# EAGLE design Temperaturfühler_V10_DLN18701 (EAGLE 9.6.0)
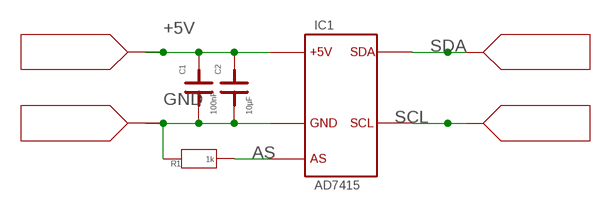
[diagram p0: schematic, sheet 1]

## Parts
C1  100nF  C1  [0805F]
C2  10µF  C1  [0805F]
IC1  AD7415  [SOT23-5L]
LP1  LP1  [LPS1]
LP2  LP1  [LPS1]
LP3  LP1  [LPS1]
LP4  LP1  [LPS1]
R1  1k  R1  [0805]

## Nets
+5V: C1.2 C2.2 IC1.3(+5V) LP3.1
AS: IC1.1(AS) R1.1
GND: C1.1 C2.1 IC1.2(GND) LP4.1 R1.2
SCL: IC1.4(SCL) LP2.1
SDA: IC1.5(SDA) LP1.1

## Library data of the parts
C1 C2 = deto:C
IC1 = deto2:AD7415: AD7415 Tempersatursensor I2C 10Bit 0,5°C
LP1-LP4 = deto:LP: Lötpunkt, SMD oder für Kabel
R1 = deto:R: Widerstand 400 mil - 0805 - 1206

## Board
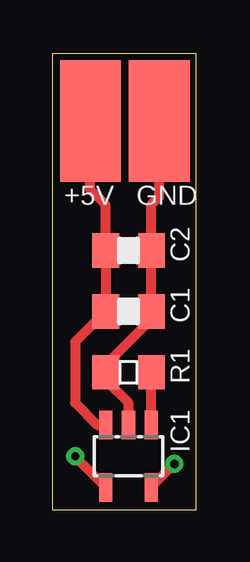
[diagram p1: board, top side]
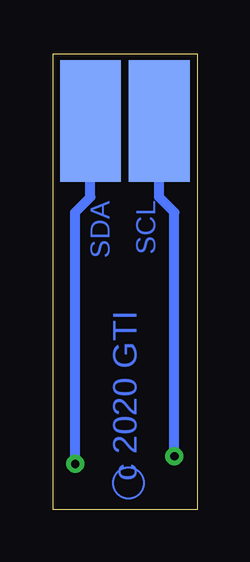
[diagram p2: board, bottom side, seen from below]

No outline drawn. Coordinates in mm, seen from the top.
Copper layers (1*16): Top 0.035mm / dielectric 1.5mm / Bottom 0.035mm
Design rules "default": minimum track width 6mil, minimum drill 0.35mm, track to track 6mil, track to pad 6mil, pad to pad 6mil, via to via 6mil, smd to smd 6mil, copper to edge 40mil, drill to drill 6mil, minimum pad ring 10mil, minimum via ring 8mil, stop-mask expansion 4mil, vias tented up to drill 0mil, thermal gap 10mil
Milling: 4 lines

### Footprints (pad centres in the part's own frame; a part is rotated, then mirrored left to right if it is on the bottom)
0805F = smd 1.118 x 1.422: 1 -0.953,0; 2 0.953,0
SOT23-5L = smd 0.55 x 1.2: 1 -0.95,-1.3; 2 0,-1.3; 3 0.95,-1.3; 4 0.95,1.3; 5 -0.95,1.3
LPS1 = smd 5.08 x 2.54: 1 0,0
0805 = smd 1.118 x 1.422: 1 -0.953,0; 2 0.953,0

### Placement (x,y rotation side)
C1  3.17,8.26 180 top
C2  3.17,10.79 180 top
IC1  3.17,2.22 180 top
LP1  4.45,16.19 90 bottom
LP2  1.59,16.19 90 bottom
LP3  1.59,16.19 90 top
LP4  4.45,16.19 90 top
R1  3.17,5.71 180 top

### Tracks (layer width: path | path; a pad name or v marks a point on that pad's centre or on a via)
+5V
  Top 0.406: LP3.1 1.59,13.34 2.22,12.7 C2.2 C1.2 0.95,6.99 0.95,4.45 1.88,3.52 IC1.3
AS
  Top 0.406: IC1.1 R1.1
GND
  Top 0.406: LP4.1 4.45,13.02 4.13,12.7 C2.1 C1.1 4.13,7.94 2.22,6.03 R1.2 2.22,5.4 3.17,4.45 IC1.2
SCL  (via drill 0.35)
  Top 0.406: IC1.4 0.95,2.19 v0.95,2.22
  Bottom 0.406: v0.95,2.22 0.95,12.38 1.59,13.02 LP2.1
SDA  (via drill 0.35)
  Top 0.406: IC1.5 4.12,0.95 v5.08,1.91
  Bottom 0.406: v5.08,1.91 5.08,12.38 4.45,13.02 LP1.1
(copper drawn outside any net)
  shapes: Bottom circle x1

### Text on the board
Bottom: SCL | SDA | c 2020 GTI
tPlace: +5V | GND